# Altium project LRB_VikramProcter_V1.0.PrjPcb
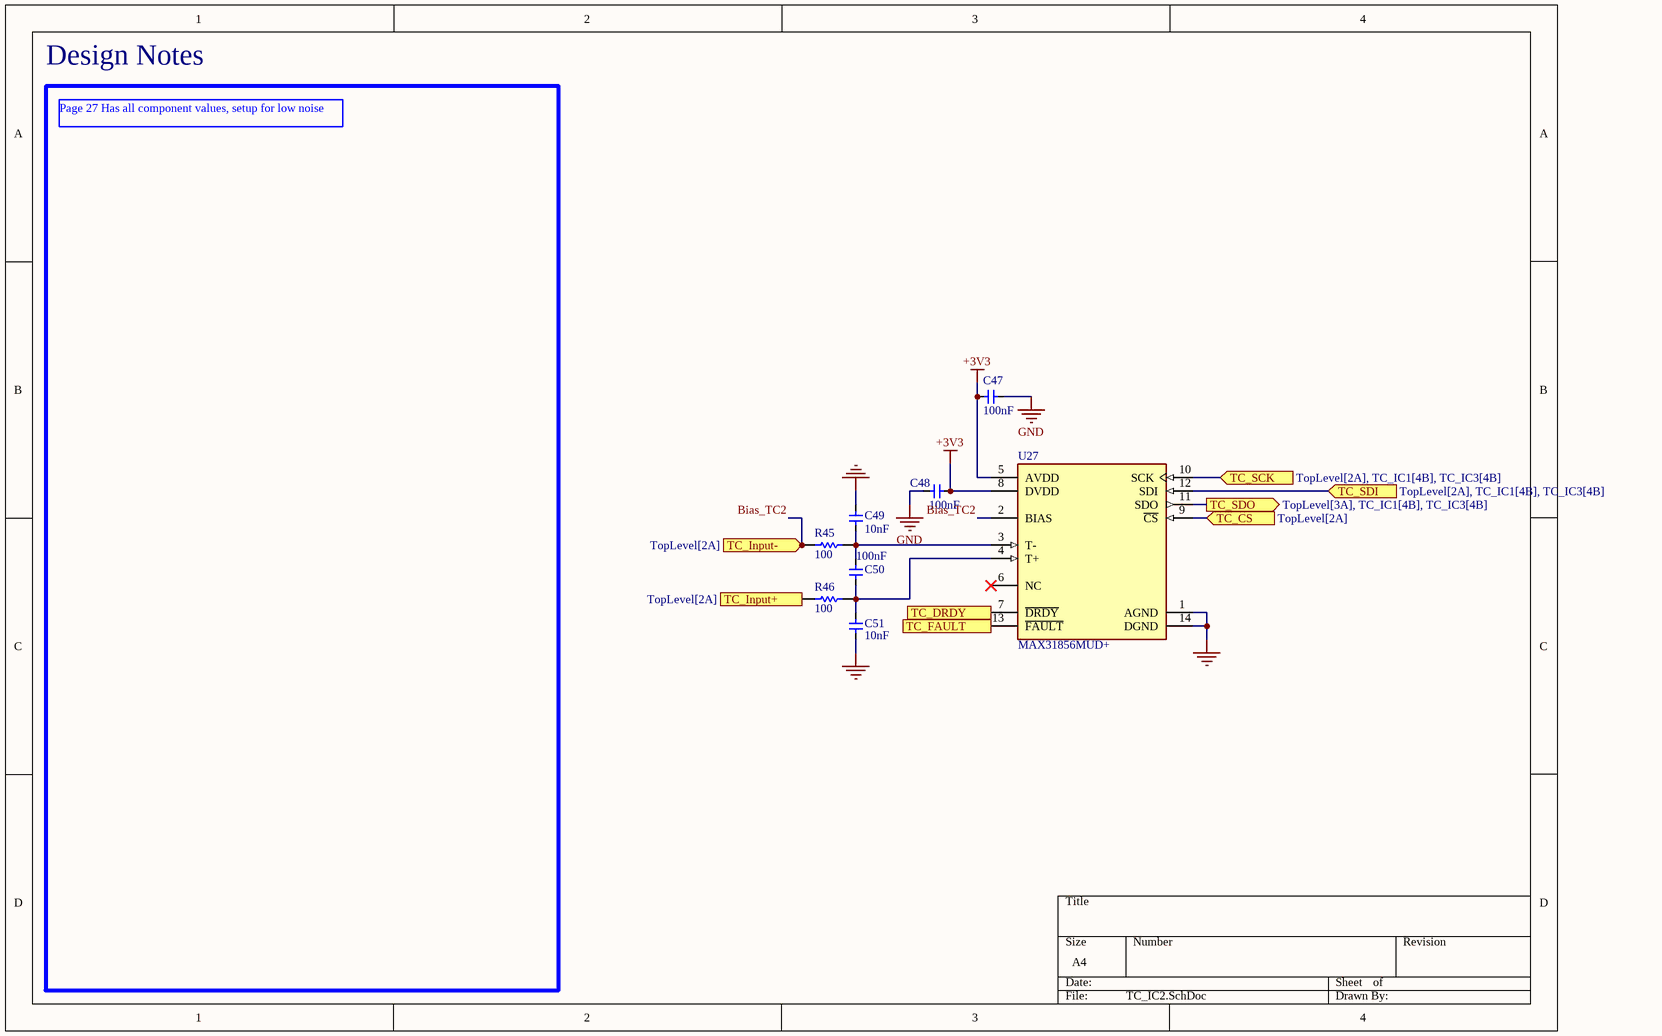
[diagram p0: TC_IC2.SchDoc]
2 sheets, 17 parts. Net scope: flat (ports and power ports of the same name join across sheets).
Board file: PCB2.PcbDoc
Sheets:
  TC_IC2.SchDoc
  LoadCellAmp2.SchDoc

## Sheet TC_IC2.SchDoc
size A4; SheetNumber: 5; SheetTotal: 11

### Parts
C47  value 100nF  [0.1uF-FP-CGA3E-0_3-0_1-IPC_A]  (hidden comment: CAP CER 0.1UF 25V 0603)
C48  value 100nF  [0.1uF-FP-CGA3E-0_3-0_1-IPC_A]  (hidden comment: CAP CER 0.1UF 25V 0603)
C49  value 10nF  [10000pF-CAP_1608_TDK]  (hidden comment: CGA3E2X7R1H103K080AA)
C50  value 100nF  [0.1uF-FP-CGA3E-0_3-0_1-IPC_A]  (hidden comment: CAP CER 0.1UF 25V 0603)
C51  value 10nF  [10000pF-CAP_1608_TDK]  (hidden comment: CGA3E2X7R1H103K080AA)
R45  value 100  [RESC1608X55X30LL15T15]  (hidden comment: ERJ-3EKF1000V)
R46  value 100  [RESC1608X55X30LL15T15]  (hidden comment: ERJ-3EKF1000V)
U27  MAX31856MUD+  [FP-U14-2-MFG]

### Ports
TC_CS (in, see TopLevel[2A]), TC_DRDY (out, see TopLevel[3A]), TC_FAULT (out, see TopLevel[3A]), TC_Input+ (in, see TopLevel[2A]), TC_Input- (in, see TopLevel[2A]), TC_SCK (in, see TopLevel[2A], TC_IC1[4B], TC_IC3[4B]), TC_SDI (in, see TopLevel[2A], TC_IC1[4B], TC_IC3[4B]), TC_SDO (out, see TopLevel[3A], TC_IC1[4B], TC_IC3[4B])

### Nets
+3V3: C47.1 C48.1 U27.5(AVDD) U27.8(DVDD)
GND: C47.2 C48.2 C49.1 C51.1 U27.1(AGND) U27.14(DGND)
Bias_TC2: R45.2 U27.2(BIAS) ; port TC_Input-
NetC49_2: C49.2 C50.2 R45.1 U27.3(T-)
NetC50_1: C50.1 C51.2 R46.1 U27.4(T+)
NetR46_2: R46.2 ; port TC_Input+
NetU27_7: U27.7(~{DRDY}) ; port TC_DRDY
NetU27_9: U27.9(~{CS}) ; port TC_CS
NetU27_10: U27.10(SCK) ; port TC_SCK
NetU27_11: U27.11(SDO) ; port TC_SDO
NetU27_12: U27.12(SDI) ; port TC_SDI
NetU27_13: U27.13(~{FAULT}) ; port TC_FAULT

Not connected (* = marked no-connect by the designer): U27 6(NC)*

### Notes on the sheet
- Design Notes
- Page 27 Has all component values, setup for low noise

### Library data of the parts
C47 C48 C50 = CMP-001-00093-3: CGA3E2X7R1E104K080AA CAP CER 0.1UF 25V X7R 0603; Manufacturer: TDK Corporation; Tolerance: 10%; Voltage - Rated: 25V; Design Item ID: CGA3E2X7R1E104K080AA; ComponentLink1URL: https://product.tdk.com/info/en/catalog/spec/mlccspec_automotive_general_en.pdf; Thickness (Max): 0.035" (0.90mm); Operating Temperature: -55°C ~ 125°C; Mounting Type: Surface Mount, MLCC; Source: PlumBay_SchLib.SchLib; Size / Dimension: 0.063" L x 0.031" W (1.60mm x 0.80mm); Case/Package: 0603 (1608 Metric); ComponentLink1Description: Datasheet; Temperature Coefficient: X7R; Manufacturer Part Number: CGA3E2X7R1E104K080AA
C49 C51 = CMP-001-00094-1: CAP CER 10000PF 50V X7R 0603; Manufacturer: TDK Corporation; Tolerance: 10%; Voltage - Rated: 50V; Thickness (Max): 0.035" (0.90mm); ComponentLink1Description: Datasheet; Temperature Coefficient: X7R; Source: PlumBay_SchLib.SchLib; Operating Temperature: -55°C ~ 125°C; Case/Package: 0603 (1608 Metric); Mounting Type: Surface Mount, MLCC; Design Item ID: CGA3E2X7R1H103K080AA; Size / Dimension: 0.063" L x 0.031" W (1.60mm x 0.80mm); Manufacturer Part Number: CGA3E2X7R1H103K080AA; ComponentLink1URL: https://product.tdk.com/info/en/catalog/spec/mlccspec_automotive_general_en.pdf
R45 R46 = CMP-009-00194-1: Fixed Resistor, Metal Glaze/thick Film, 0.1W, 100ohm, 75V, 1% +/-Tol, 100ppm/Cel, Surface Mount, 0603; Power: 100mW; Pins: 2; Tolerance: 1%; RoHS Compliant: Yes; Case/Package: 0603; Min Operating Temperature: -55°C; Max Operating Temperature: 155°C; Mounting Technology: Surface Mount
U27 = CMP-015-00011-1: Analog Circuit, 1 Func, PDSO14; Max Supply Voltage: 3.6V; Min Supply Voltage: 3V; Nominal Supply Voltage: 3.3V; Pins: 14; Min Operating Temperature: -55°C; Case/Package: TSSOP; RoHS Compliant: Yes; Max Operating Temperature: 125°C

## Sheet LoadCellAmp2.SchDoc
size A4; SheetNumber: 10; SheetTotal: 11
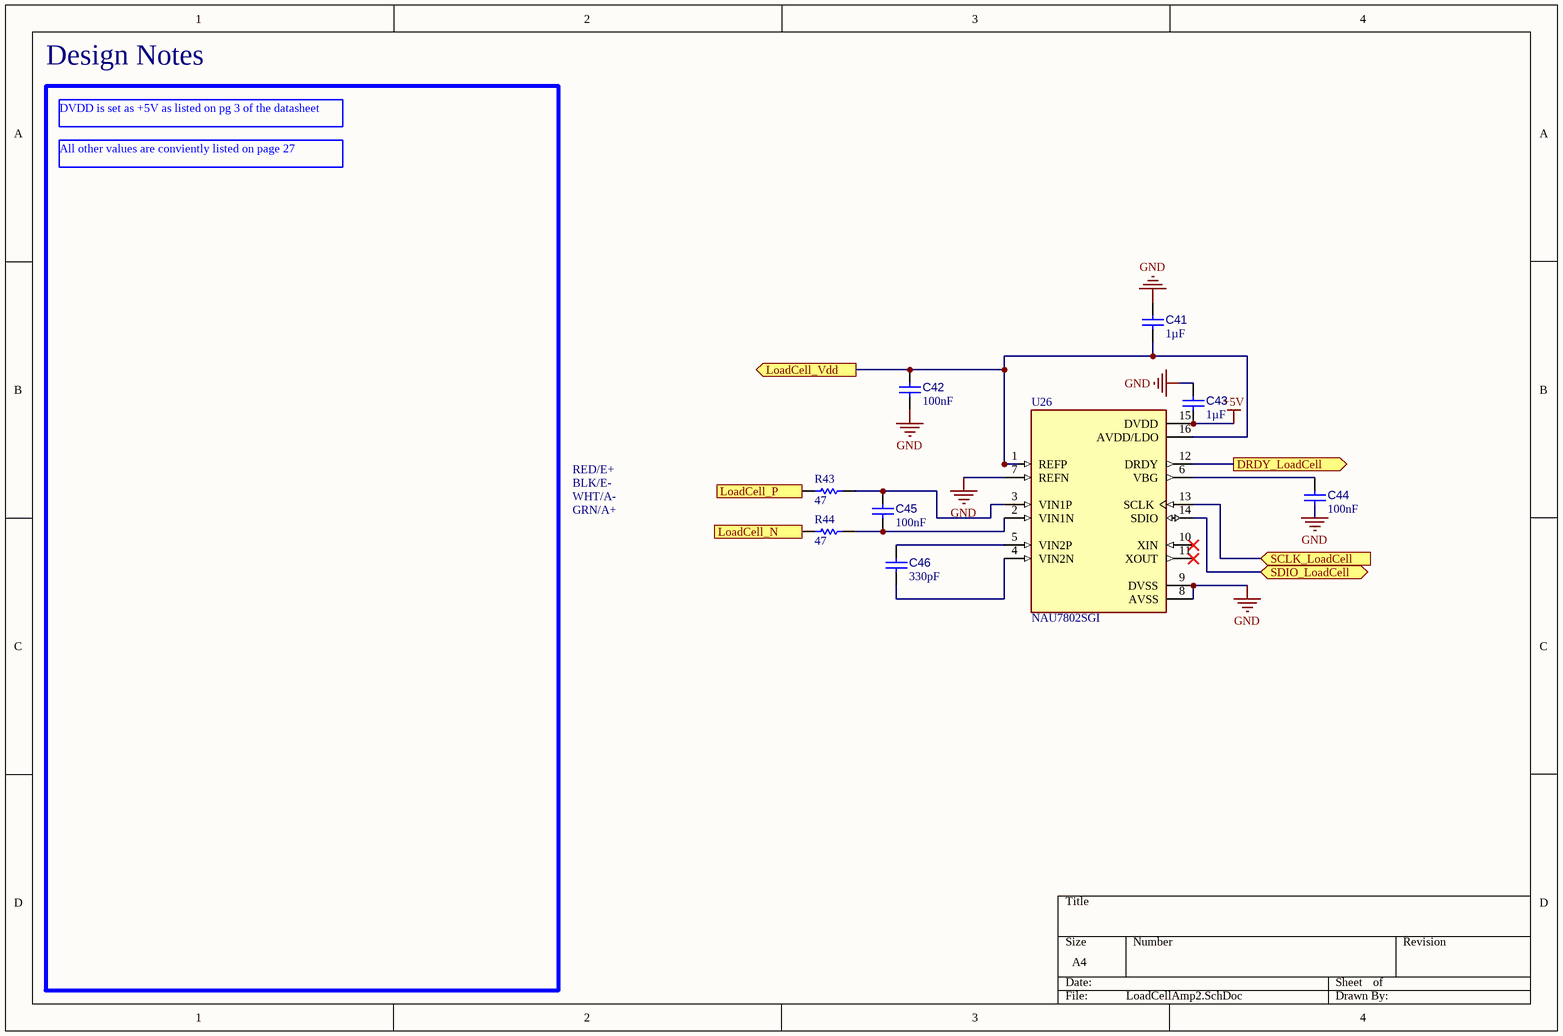
[diagram p1: LoadCellAmp2.SchDoc]

### Parts
C41  value 1µF  [CAPC2013X135X45ML10T25]  (hidden comment: Capacitor 1 uF +/- 10% 50 V 0805)
C42  value 100nF  [CAPC1608X90X40NL10T20]  (hidden comment: Capacitor 100 nF +/-10% 50 V 0603)
C43  value 1µF  [CAPC2013X135X45ML10T25]  (hidden comment: Capacitor 1 uF +/- 10% 50 V 0805)
C44  value 100nF  [CAPC1608X90X40NL10T20]  (hidden comment: Capacitor 100 nF +/-10% 50 V 0603)
C45  value 100nF  [CAPC1608X90X40NL10T20]  (hidden comment: Capacitor 100 nF +/-10% 50 V 0603)
C46  value 330pF  [CAP_0603]  (hidden comment: CAP CER 330pF 50V 1% 0603)
R43  value 47  [RESC1608X50X30ML20T20]  (hidden comment: RG1608N-470-W-T1)
R44  value 47  [RESC1608X50X30ML20T20]  (hidden comment: RG1608N-470-W-T1)
U26  NAU7802SGI  [NAU7802SGI-Footprint-1]

### Ports
DRDY_LoadCell (out, see TopLevel[1B]), LoadCell_N (in, see TopLevel[1B]), LoadCell_P (in, see TopLevel[1B]), LoadCell_Vdd (out, see TopLevel[1B]), SCLK_LoadCell (in, see TopLevel[1B], LoadCellAmp1[4C]), SDIO_LoadCell (bidir, see TopLevel[1B], LoadCellAmp1[4C])

### Nets
+5V: C43.1 U26.15(DVDD)
GND: C41.2 C42.1 C43.2 C44.1 U26.7(REFN) U26.8(AVSS) U26.9(DVSS)
NetC41_1: C41.1 C42.2 U26.1(REFP) U26.16(AVDD/LDO) ; port LoadCell_Vdd
NetC44_2: C44.2 U26.6(VBG)
NetC45_1: C45.1 R44.2 U26.2(VIN1N)
NetC45_2: C45.2 R43.2 U26.3(VIN1P)
NetC46_1: C46.1 U26.4(VIN2N)
NetC46_2: C46.2 U26.5(VIN2P)
NetR43_1: R43.1 ; port LoadCell_P
NetR44_1: R44.1 ; port LoadCell_N
NetU26_12: U26.12(DRDY) ; port DRDY_LoadCell
NetU26_13: U26.13(SCLK) ; port SCLK_LoadCell
NetU26_14: U26.14(SDIO) ; port SDIO_LoadCell

Not connected (* = marked no-connect by the designer): U26 10(XIN)* 11(XOUT)*

### Notes on the sheet
- Design Notes
- DVDD is set as +5V as listed on pg 3 of the datasheet
- All other values are conviently listed on page 27
- GRN/A+
- WHT/A-
- BLK/E-
- RED/E+

### Library data of the parts
C41 C43 = CMP-001-00007-7: Chip Capacitor, 1 uF, +/- 10%, 50 V, 0805 (2012 Metric); Voltage Rating: 50V; Capacitor Type: Ceramic; Pins: 2; RoHS Compliant: True; Case/Package: 0805; Min Operating Temperature: -55°C; Max Operating Temperature: 125°C; Mounting Technology: SM; Tolerance: 10%
C42 C44 C45 = CMP-001-00017-7: Chip Capacitor, 100 nF, +/- 10%, 50 V, 0603 (1608 Metric); Voltage Rating: 50V; Capacitor Type: Ceramic; Mounting Technology: SM; Case/Package: 0603; Tolerance: 10%; Max Operating Temperature: 125°C; Min Operating Temperature: -55°C; Pins: 2; RoHS Compliant: True
C46 = CMP-001-00107-2: KGM15ACG1H331FT - Cap Ceramic 330pF 50V C0G 1% Pad SMD 0603 125C T/R; Pins: 2; Case/Package: 0603; Capacitor Type: Ceramic; Mounting Technology: Surface Mount; Min Operating Temperature: -55°C; Max Operating Temperature: 125°C; RoHS Compliant: Yes
R43 R44 = CMP-009-00323-1: Fixed Resistor, Metal Film, 0.1W, 47ohm, 75V, 0.05% +/-Tol, 10ppm/Cel, Surface Mount, 0603; Power: 100mW; Max Operating Temperature: 155°C; Pins: 2; Tolerance: 0.05%; Case/Package: 0603; Min Operating Temperature: -55°C; RoHS Compliant: Yes; Mounting Technology: Surface Mount
U26 = CMP-014-00002-1: ADC, Delta-Sigma, 24-Bit, 1 Func, 2 Channel, Serial Access, PDSO16

## Nets that join several sheets
GND: TC_IC2 (6 pins), LoadCellAmp2 (7 pins)